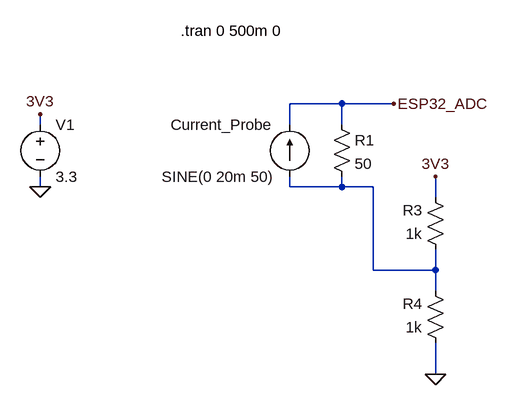
[diagram p0: schematic current_probe.asc]
current_probe.asc, the LTspice schematic file:
Version 4
SHEET 1 880 680
WIRE 176 32 96 32
WIRE 256 32 176 32
WIRE -288 64 -288 48
WIRE 96 64 96 32
WIRE 176 64 176 32
WIRE -288 160 -288 144
WIRE 96 160 96 144
WIRE 176 160 176 144
WIRE 176 160 96 160
WIRE 224 160 176 160
WIRE 320 176 320 144
WIRE 224 288 224 160
WIRE 320 288 320 256
WIRE 320 288 224 288
WIRE 320 320 320 288
WIRE 320 448 320 400
FLAG -288 160 0
FLAG -288 48 3V3
FLAG 320 144 3V3
FLAG 320 448 0
FLAG 256 32 ESP32_ADC
SYMBOL voltage -288 48 R0
WINDOW 123 0 0 Left 0
WINDOW 39 0 0 Left 0
SYMATTR InstName V1
SYMATTR Value 3.3
SYMBOL current 96 144 R180
WINDOW 0 24 80 Left 2
WINDOW 3 24 0 Left 2
WINDOW 123 0 0 Left 0
WINDOW 39 0 0 Left 0
SYMATTR InstName Current_Probe
SYMATTR Value SINE(0 20m 50)
SYMBOL res 160 48 R0
SYMATTR InstName R1
SYMATTR Value 50
SYMBOL res 336 272 R180
WINDOW 0 36 76 Left 2
WINDOW 3 36 40 Left 2
SYMATTR InstName R3
SYMATTR Value 1k
SYMBOL res 336 416 R180
WINDOW 0 36 76 Left 2
WINDOW 3 36 40 Left 2
SYMATTR InstName R4
SYMATTR Value 1k
TEXT -72 -80 Left 2 !.tran 0 500m 0

The netlist it stands for:
* current_probe.asc
V1 3V3 0 3.3
I§Current_Probe N001 ESP32_ADC SINE(0 20m 50)
R1 ESP32_ADC N001 50
R3 N001 3V3 1k
R4 0 N001 1k
.tran 0 500m 0
.backanno
.end